# EAGLE design LazrFinal (EAGLE 9.1.3)
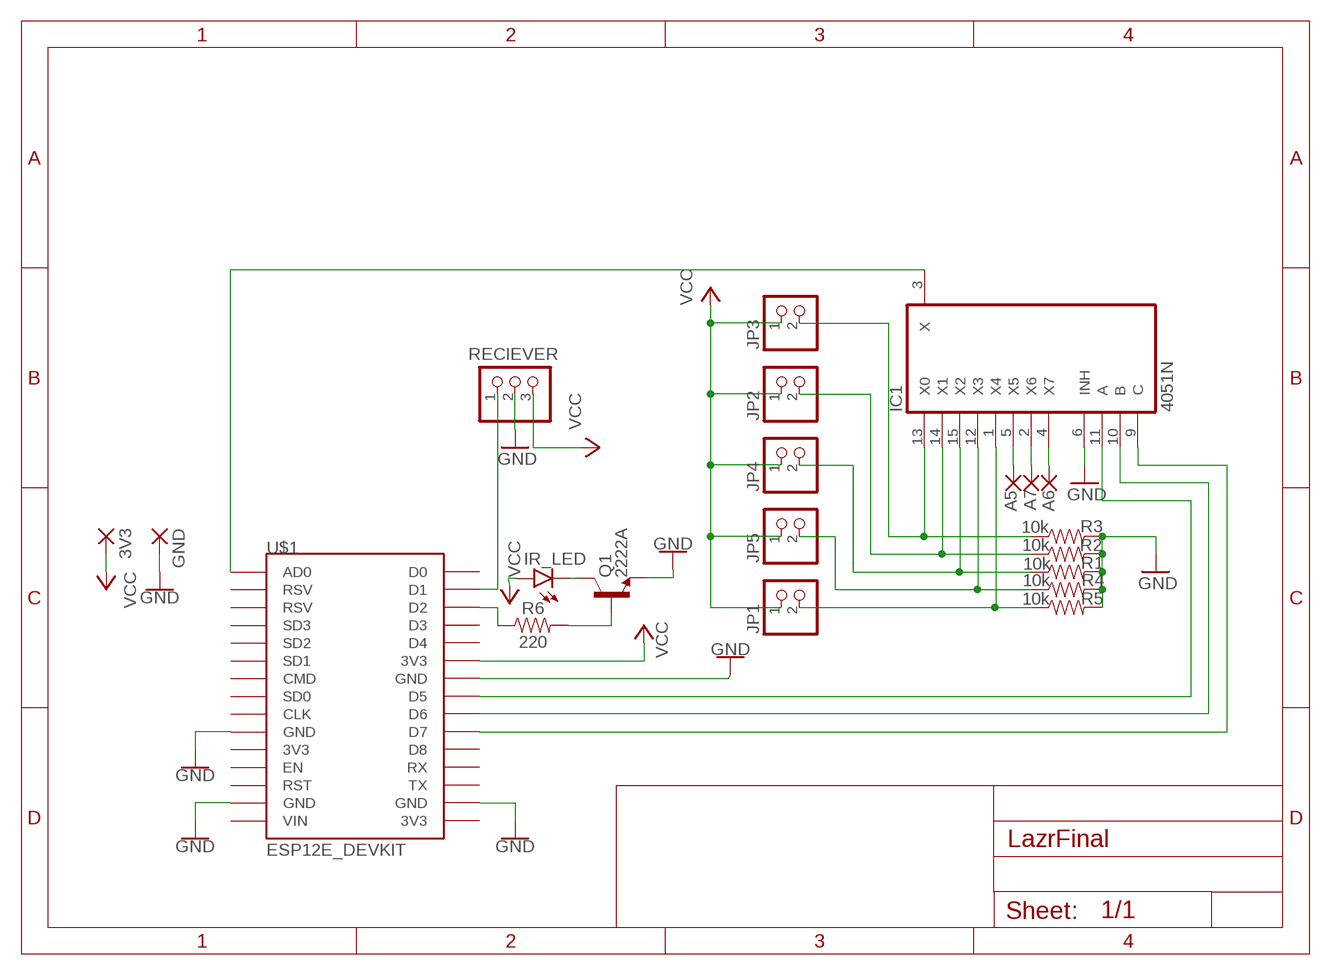
[diagram p0: schematic, sheet 1]

## Parts
3V3  SMD5  [SMD2,54-5,08]
A5  SMD2  [SMD1,27-2,54]
A6  SMD2  [SMD1,27-2,54]
A7  SMD2  [SMD1,27-2,54]
GND  SMD5  [SMD2,54-5,08]
IC1  4051N  [DIL16]
IR_LED  LED-IRTSAL6100  [LED_5MM]
JP1  PINHD-1X2  [1X02]
JP2  PINHD-1X2  [1X02]
JP3  PINHD-1X2  [1X02]
JP4  PINHD-1X2  [1X02]
JP5  PINHD-1X2  [1X02]
Q1  2222A  TRANS_NPN-2N3904  [TO-92]
R1  10k  10KOHM-HORIZ-1/4W-5%  [AXIAL-0.3]
R2  10k  10KOHM-HORIZ-1/4W-5%  [AXIAL-0.3]
R3  10k  10KOHM-HORIZ-1/4W-5%  [AXIAL-0.3]
R4  10k  10KOHM-HORIZ-1/4W-5%  [AXIAL-0.3]
R5  10k  10KOHM-HORIZ-1/4W-5%  [AXIAL-0.3]
R6  220  1KOHM-HORIZ-1/4W-5%  [AXIAL-0.3]
RECIEVER  PINHD-1X3  [1X03]
U$1  ESP12E_DEVKIT  [ESP12E_DEVKIT]

## Nets
GND: GND.1(P) IC1.6(INH) Q1.1(E) R1.P$2 R2.P$2 R3.P$2 R4.P$2 R5.P$2 RECIEVER.2 U$1.GND@0(GND) U$1.GND@1(GND) U$1.GND@2(GND) U$1.GND@3(GND)
N$1: IC1.3(X) U$1.AD0
N$2: IC1.11(A) U$1.D5
N$3: IC1.10(B) U$1.D6
N$4: IC1.9(C) U$1.D7
N$5: IC1.13(X0) JP3.2 R3.P$1
N$6: IC1.14(X1) JP2.2 R2.P$1
N$7: IC1.15(X2) JP4.2 R1.P$1
N$8: IC1.12(X3) JP5.2 R4.P$1
N$9: IC1.1(X4) JP1.2 R5.P$1
N$10: R6.P$1 U$1.D2
N$11: RECIEVER.1 U$1.D1
N$12: IR_LED.K(C) Q1.3(C)
N$13: Q1.2(B) R6.P$2
N$17: A5.1(P) IC1.5(X5)
N$18: A7.1(P) IC1.2(X6)
N$19: A6.1(P) IC1.4(X7)
VCC: 3V3.1(P) IR_LED.A JP1.1 JP2.1 JP3.1 JP4.1 JP5.1 RECIEVER.3 U$1.3V3@1(3V3)
Unconnected: U$1.3V3@0(3V3) U$1.3V3@2(3V3) U$1.CLK U$1.CMD U$1.D0 U$1.D3 U$1.D4 U$1.D8 U$1.EN U$1.RST U$1.RSV@0(RSV) U$1.RSV@1(RSV) U$1.RX U$1.SD0 U$1.SD1 U$1.SD2 U$1.SD3 U$1.TX U$1.VIN

## Power pins joined to a net without a drawn wire
GND: IC1.8(GND)
VCC: IC1.16(VCC)
VEE: IC1.7(VEE)

## Library data of the parts
3V3 GND = wirepad:SMD5: SMD PAD
A5-A7 = wirepad:SMD2: SMD PAD
IC1 = 40xx:4051: 8-channel ANALOG MULTIPLEXER
IR_LED = SparkFun-LED:LED-IR: Infrared LED (IR) Wavelength: 940nm Packages: TSAL6100 LTE302 - Side firing. Check SparkFun-Sensors.lbr for the receiver SparkFun Products: ZX Distance and Gesture Sensor <[https://www.sparkfun.com/products/12780]> Infrared Emitters and Detectors <https://www.sparkfun.com/products/241>; PROD_ID: DIO-12058
JP1-JP5 = pinhead:PINHD-1X2: PIN HEADER
Q1 = SparkFun-DiscreteSemi:TRANS_NPN: NPN transistor Current controlled devices typically used to amplify current or used as a switch. BC547 - COM-08928 <http://www.sparkfun.com/products/8928> (TO-92 45V 100mA) (1.Collector 2.Base 3.Emitter) 2N3904 - COM-00521 <http://www.sparkfun.com/products/521> (TO-92 40V 200mA) (1.Emitter 2.Base 3.Collector) P2N2222A - COM-12852 <http://www.sparkfun.com/products/12852> (TO-92 40V 600mA) (1.Collector 2.Base 3.Emitter); PROD_ID: TRANS-08447; VALUE: 200mA/40V
R1-R5 = SparkFun-Resistors:10KOHM: 10kΩ resistor A resistor is a passive two-terminal electrical component that implements electrical resistance as a circuit element. Resistors act to reduce current flow, and, at the same time, act to lower voltage levels within circuits. - Wikipedia; PROD_ID: RES-09435
R6 = SparkFun-Resistors:1KOHM: 1kΩ resistor A resistor is a passive two-terminal electrical component that implements electrical resistance as a circuit element. Resistors act to reduce current flow, and, at the same time, act to lower voltage levels within circuits. - Wikipedia; PROD_ID: RES-08380; VALUE: 1k
RECIEVER = pinhead:PINHD-1X3: PIN HEADER
U$1 = ESP12E_DEVKIT:ESP12E_DEVKIT: ESP12E DEVKIT BOARD

## Board
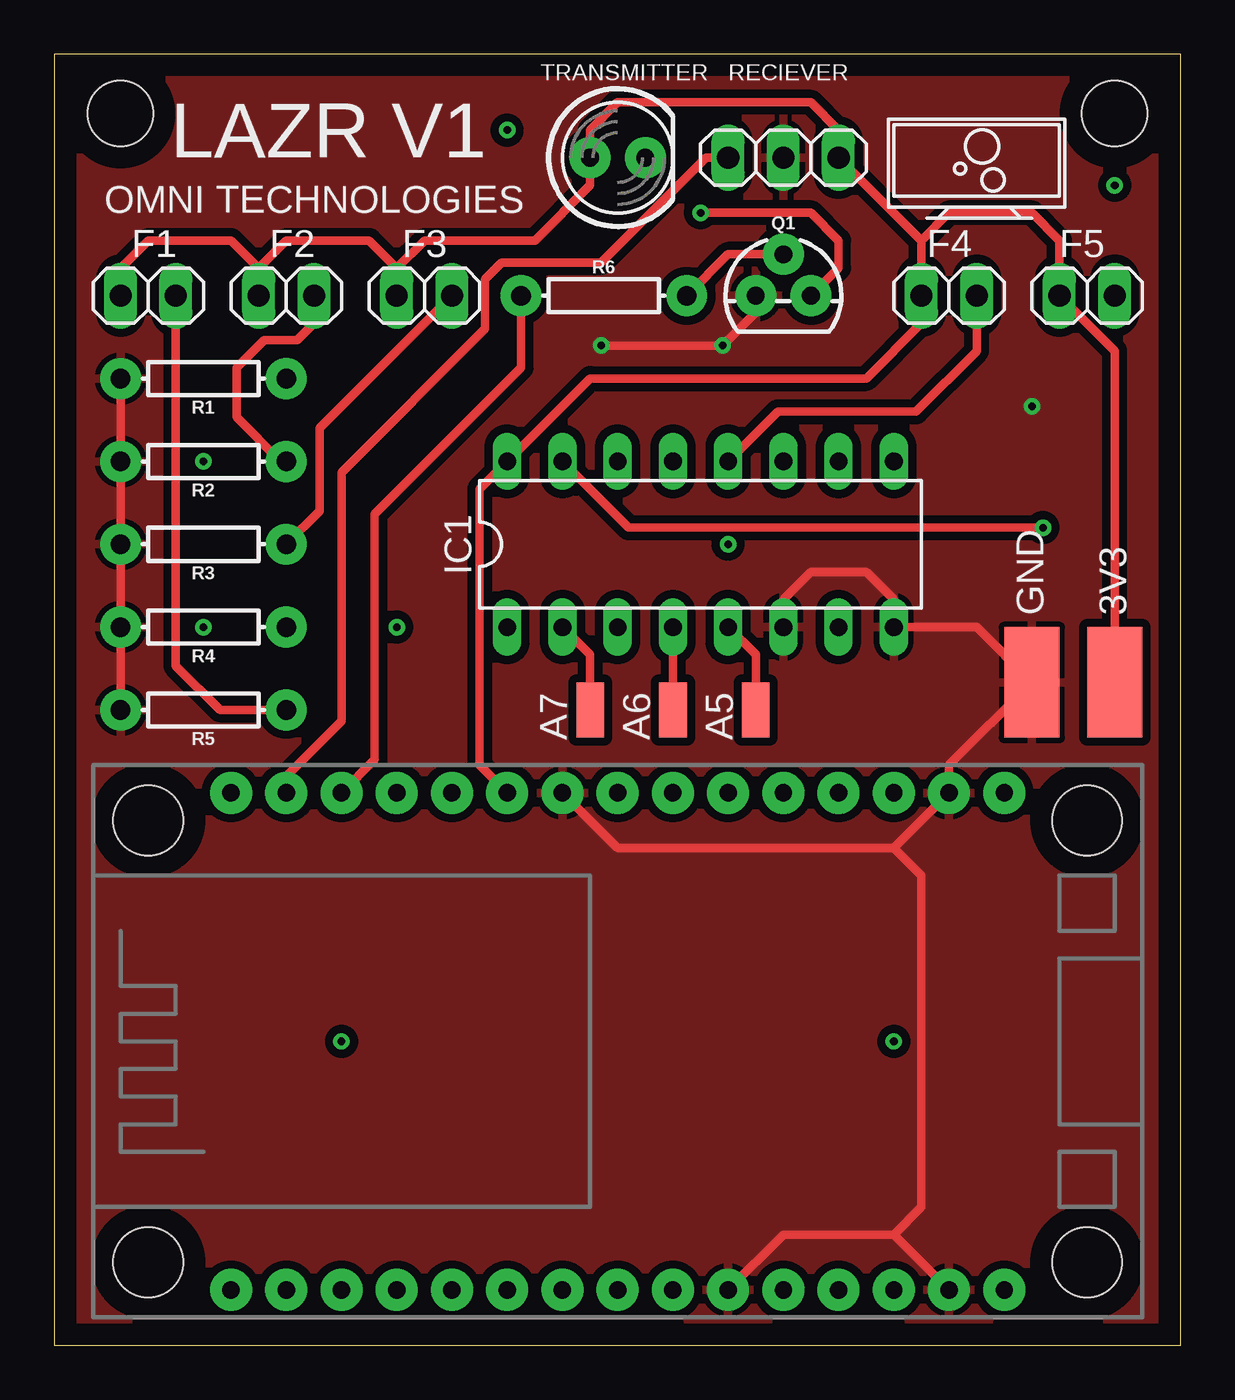
[diagram p1: board, top side]
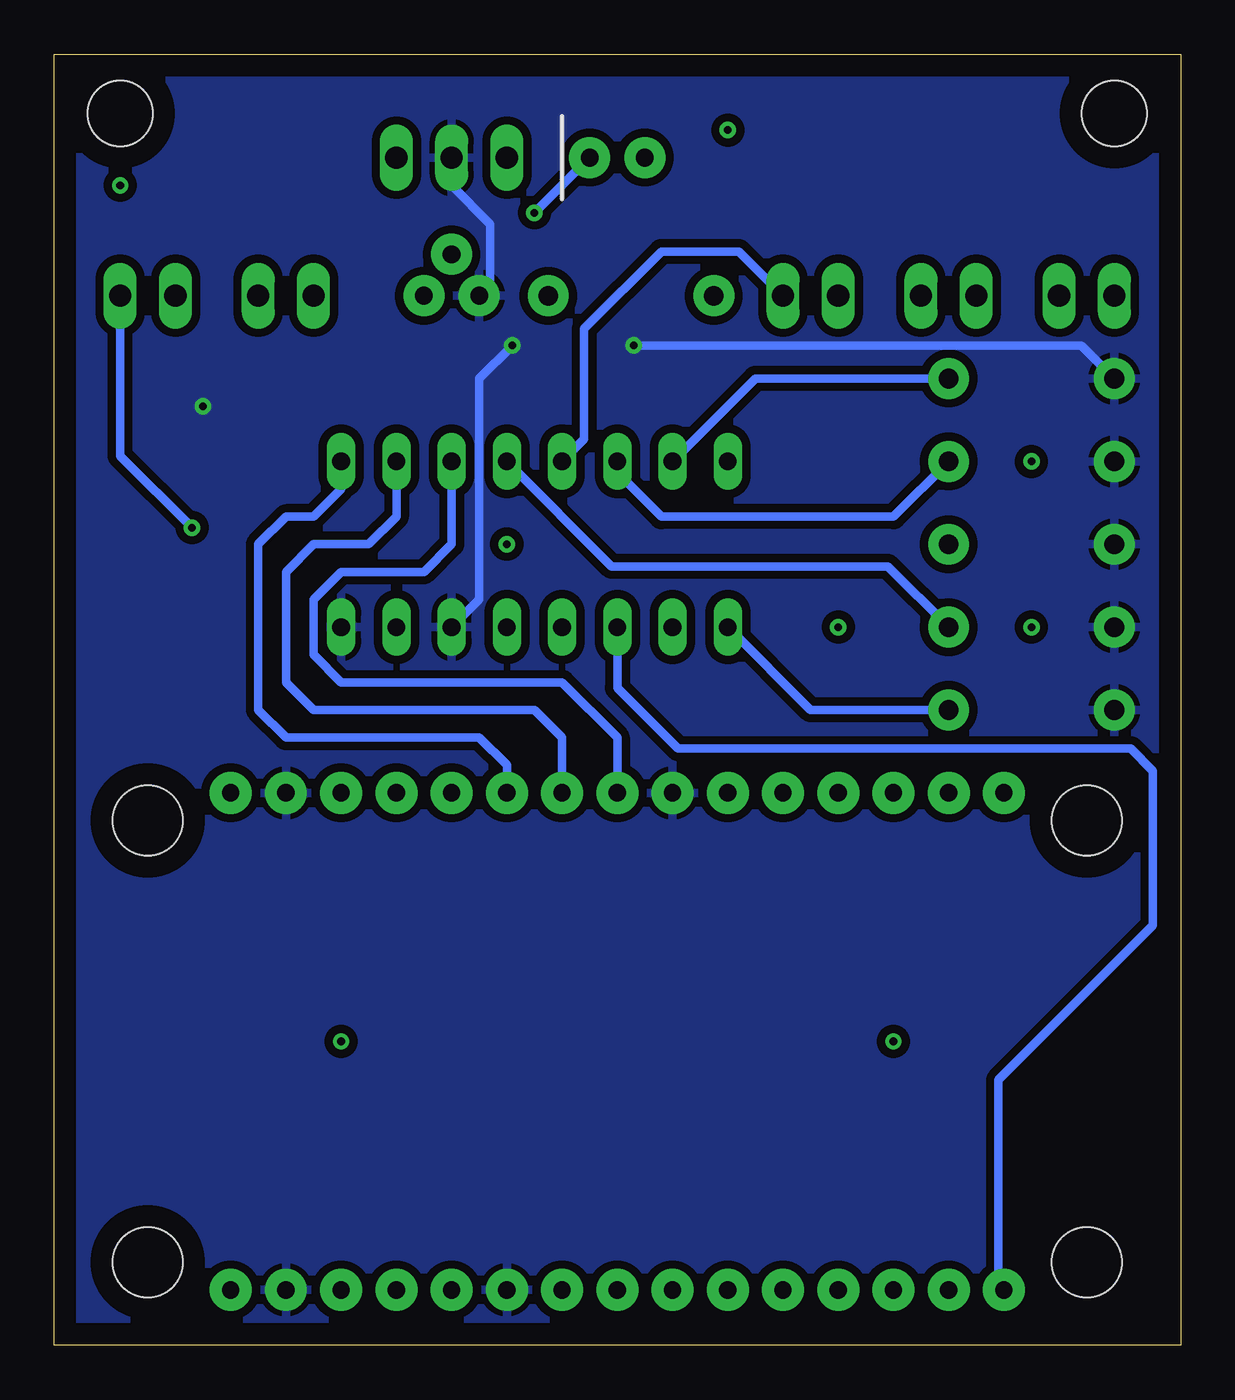
[diagram p2: board, bottom side, seen from below]

Size 51.8 x 59.36 mm. Coordinates in mm from the lower left corner, seen from the top.
Outline: 0,0 51.8,0 51.8,59.36 0,59.36 0,0
Copper layers (1*16): Top 0.035mm / dielectric 1.5mm / Bottom 0.035mm
Design rules "default": minimum track width 6mil, minimum drill 0.35mm, track to track 6mil, track to pad 6mil, pad to pad 6mil, via to via 6mil, smd to smd 6mil, copper to edge 40mil, drill to drill 6mil, minimum pad ring 10mil, minimum via ring 8mil, stop-mask expansion 4mil, vias tented up to drill 0mil, thermal gap 10mil
Holes 3 mm at 3.05,56.64 48.77,56.64

### Footprints (pad centres in the part's own frame; a part is rotated, then mirrored left to right if it is on the bottom)
SMD2,54-5,08 = smd 2.54 x 5.08: 1 0,0
SMD1,27-2,54 = smd 1.27 x 2.54: 1 0,0
DIL16 = drill 0.813 long: 1 -8.89,-3.81; 2 -6.35,-3.81; 3 -3.81,-3.81; 4 -1.27,-3.81; 5 1.27,-3.81; 6 3.81,-3.81; 7 6.35,-3.81; 8 8.89,-3.81; 9 8.89,3.81; 10 6.35,3.81; 11 3.81,3.81; 12 1.27,3.81; 13 -1.27,3.81; 14 -3.81,3.81; 15 -6.35,3.81; 16 -8.89,3.81
LED_5MM = drill 0.813 pad 1.88: A -1.27,0; K 1.27,0
1X02 = drill 1.016 long: 1 -1.27,0; 2 1.27,0
TO-92 = drill 0.813 pad 1.88: 1 -1.27,0; 2 0,1.905; 3 1.27,0
AXIAL-0.3 = drill 0.9 pad 1.88: P$1 -3.81,0; P$2 3.81,0
1X03 = drill 1.016 long: 1 -2.54,0; 2 0,0; 3 2.54,0
ESP12E_DEVKIT = drill 0.8 pad 1.93: 3V3@0 -11.43,-7.62; 3V3@1 11.43,5.08; 3V3@2 11.43,-17.78; AD0 -11.43,17.78; CLK -11.43,-2.54; CMD -11.43,2.54; D0 11.43,17.78; D1 11.43,15.24; D2 11.43,12.7; D3 11.43,10.16; D4 11.43,7.62; D5 11.43,0; D6 11.43,-2.54; D7 11.43,-5.08; D8 11.43,-7.62; EN -11.43,-10.16; GND@0 -11.43,-5.08; GND@1 -11.43,-15.24; GND@2 11.43,2.54; GND@3 11.43,-15.24; RST -11.43,-12.7; RSV@0 -11.43,15.24; RSV@1 -11.43,12.7; RX 11.43,-10.16; SD0 -11.43,0; SD1 -11.43,5.08; SD2 -11.43,7.62; SD3 -11.43,10.16; TX 11.43,-12.7; VIN -11.43,-17.78 | hole 3.2: -10.16,21.59; 10.16,21.59; 10.16,-21.59; -10.16,-21.59

### Placement (x,y rotation side)
3V3  48.77,30.48 0 top
A5  32.26,29.21 0 top
A6  28.45,29.21 0 top
A7  24.64,29.21 0 top
GND  44.96,30.48 0 top
IC1  29.72,36.83 0 top
IR_LED  25.91,54.61 0 top
JP1  4.32,48.26 0 top
JP2  10.67,48.26 0 top
JP3  17.02,48.26 0 top
JP4  47.5,48.26 0 top
JP5  41.15,48.26 0 top
Q1  33.53,48.26 0 top
R1  6.86,44.45 180 top
R2  6.86,40.64 180 top
R3  6.86,36.83 180 top
R4  6.86,33.02 180 top
R5  6.86,29.21 180 top
R6  25.27,48.26 0 top
RECIEVER  33.53,54.61 0 top
U$1  25.91,13.97 90 top

### Tracks (layer width: path | path; a pad name or v marks a point on that pad's centre or on a via)
GND  (via drill 0.35)
  Top 0.381: U$1.GND@1 38.61,5.08 | 38.61,5.08 33.53,5.08 U$1.GND@0 | 38.61,22.86 U$1.GND@3 41.15,26.67 GND.1 42.42,33.02 IC1.8 38.61,34.29 37.34,35.56 34.8,35.56 33.53,34.29 IC1.6 | 38.61,22.86 25.91,22.86 U$1.GND@2 | 38.61,22.86 39.88,21.59 39.88,6.35 38.61,5.08 | R5.P$2 R4.P$2 R3.P$2 R2.P$2 R1.P$2 | Q1.1 32.26,47.5 30.86,46.1 v30.73,45.97 v25.15,45.97
  Bottom 0.381: RECIEVER.2 33.53,53.34 31.75,51.56 31.75,48.77 Q1.1 | IC1.6 32.26,34.29 32.26,44.45 v30.73,45.97 | R1.P$2 4.57,45.97 v25.15,45.97
  other vias: 44.96,43.18
  pour Top (isolate 0.381): 0.51,59.69 51.31,59.69 51.31,0 0.51,0
  pour Bottom (isolate 0.381): 0.51,59.69 52.58,59.69 52.58,0 0.51,0
N$1
  Bottom 0.381: U$1.AD0 8.38,2.79 8.38,12.19 1.27,19.3 1.27,26.42 2.29,27.43 23.11,27.43 25.91,30.23 IC1.3
N$2
  Bottom 0.381: IC1.11 33.53,36.83 34.8,35.56 38.61,35.56 39.88,34.29 39.88,31.75 38.61,30.48 28.45,30.48 25.91,27.94 U$1.D5
N$3
  Bottom 0.381: U$1.D6 28.45,27.94 29.72,29.21 39.88,29.21 41.15,30.48 41.15,35.56 39.88,36.83 37.34,36.83 36.07,38.1 IC1.10
N$4
  Bottom 0.381: IC1.9 38.61,39.37 39.88,38.1 41.15,38.1 42.42,36.83 42.42,29.21 41.15,27.94 32.26,27.94 30.99,26.67 U$1.D7
N$5
  Top 0.381: JP3.2 12.19,42.16 12.19,38.35 R3.P$1
  Bottom 0.381: JP3.2 20.32,50.29 23.88,50.29 27.43,46.74 27.43,41.66 IC1.13
N$6
  Top 0.381: JP2.2 11.94,46.99 11.18,46.23 9.65,46.23 8.38,44.96 8.38,42.67 10.41,40.64 R2.P$1
  Bottom 0.381: R2.P$1 13.21,38.1 23.88,38.1 25.91,40.13 IC1.14
N$7  (via drill 0.35)
  Top 0.381: IC1.15 26.42,37.59 v45.47,37.59
  Bottom 0.381: v45.47,37.59 48.77,40.89 JP4.2 | R1.P$1 19.56,44.45 IC1.15
N$8
  Top 0.381: IC1.12 33.27,42.93 39.62,42.93 42.42,45.72 JP5.2
  Bottom 0.381: R4.P$1 13.46,35.81 26.16,35.81 IC1.12
N$9
  Top 0.381: JP1.2 5.59,31.24 7.62,29.21 R5.P$1
  Bottom 0.381: R5.P$1 17.02,29.21 IC1.1
N$10
  Top 0.381: R6.P$1 21.46,44.96 14.73,38.23 14.73,26.92 U$1.D2
N$11
  Top 0.381: U$1.D1 10.67,26.16 13.21,28.7 13.21,40.13 19.81,46.74 19.81,49.02 20.57,49.78 25.15,49.78 29.97,54.61 RECIEVER.1
N$12  (via drill 0.35)
  Top 0.381: Q1.3 36.07,49.53 36.07,50.8 34.8,52.07 v29.72,52.07
  Bottom 0.381: v29.72,52.07 IR_LED.K
N$13
  Top 0.381: Q1.2 30.99,50.16 R6.P$2
N$15  (via drill 0.35)
  other vias: 20.83,55.88
N$17
  Top 0.381: IC1.5 32.26,31.75 A5.1
N$18
  Top 0.381: IC1.2 24.64,31.75 A7.1
N$19
  Top 0.381: IC1.4 A6.1
N$23  (via drill 0.35)
  other vias: 48.77,53.34
N$24  (via drill 0.35)
  other vias: 13.21,13.97
N$25  (via drill 0.35)
  other vias: 38.61,13.97
N$26  (via drill 0.35)
  other vias: 15.75,33.02
N$27  (via drill 0.35)
  other vias: 30.99,36.83
N$28  (via drill 0.35)
  other vias: 6.86,33.02
N$29  (via drill 0.35)
  other vias: 6.86,40.64
VCC
  Top 0.381: JP2.1 9.4,49.53 | 9.4,49.53 8.13,50.8 4.32,50.8 3.05,49.53 JP1.1 | JP3.1 15.75,49.53 | 15.75,49.53 14.48,50.8 10.67,50.8 9.4,49.53 | 39.88,50.8 JP5.1 39.88,46.99 37.34,44.45 24.64,44.45 IC1.16 19.56,39.37 19.56,26.67 U$1.3V3@1 | 39.88,50.8 RECIEVER.3 36.07,55.88 34.8,57.15 25.91,57.15 24.64,55.88 IR_LED.A 24.64,53.34 22.1,50.8 17.02,50.8 15.75,49.53 | 39.88,50.8 41.15,52.07 44.96,52.07 46.23,50.8 JP4.1 48.77,45.72 3V3.1

### Text on the board
tNames: TRANSMITTER | RECIEVER | LAZR V1 | OMNI TECHNOLOGIES | F1 | F2 | F3 | F4 | F5